# Altium schematic sheet LibreSolar_BMS48V_1.SchDoc: LibreSolar_BMS48V
size 410 x 286 mm; Date: 2018-10-18 5:55:55 PM; SheetNumber: 2; GateName_1: G$1; SymbolName_1: DINA3_L; LibraryName: frames; DeviceSetName: DINA3_L; GateName_2: G$2; SymbolName_2: DOCFIELD
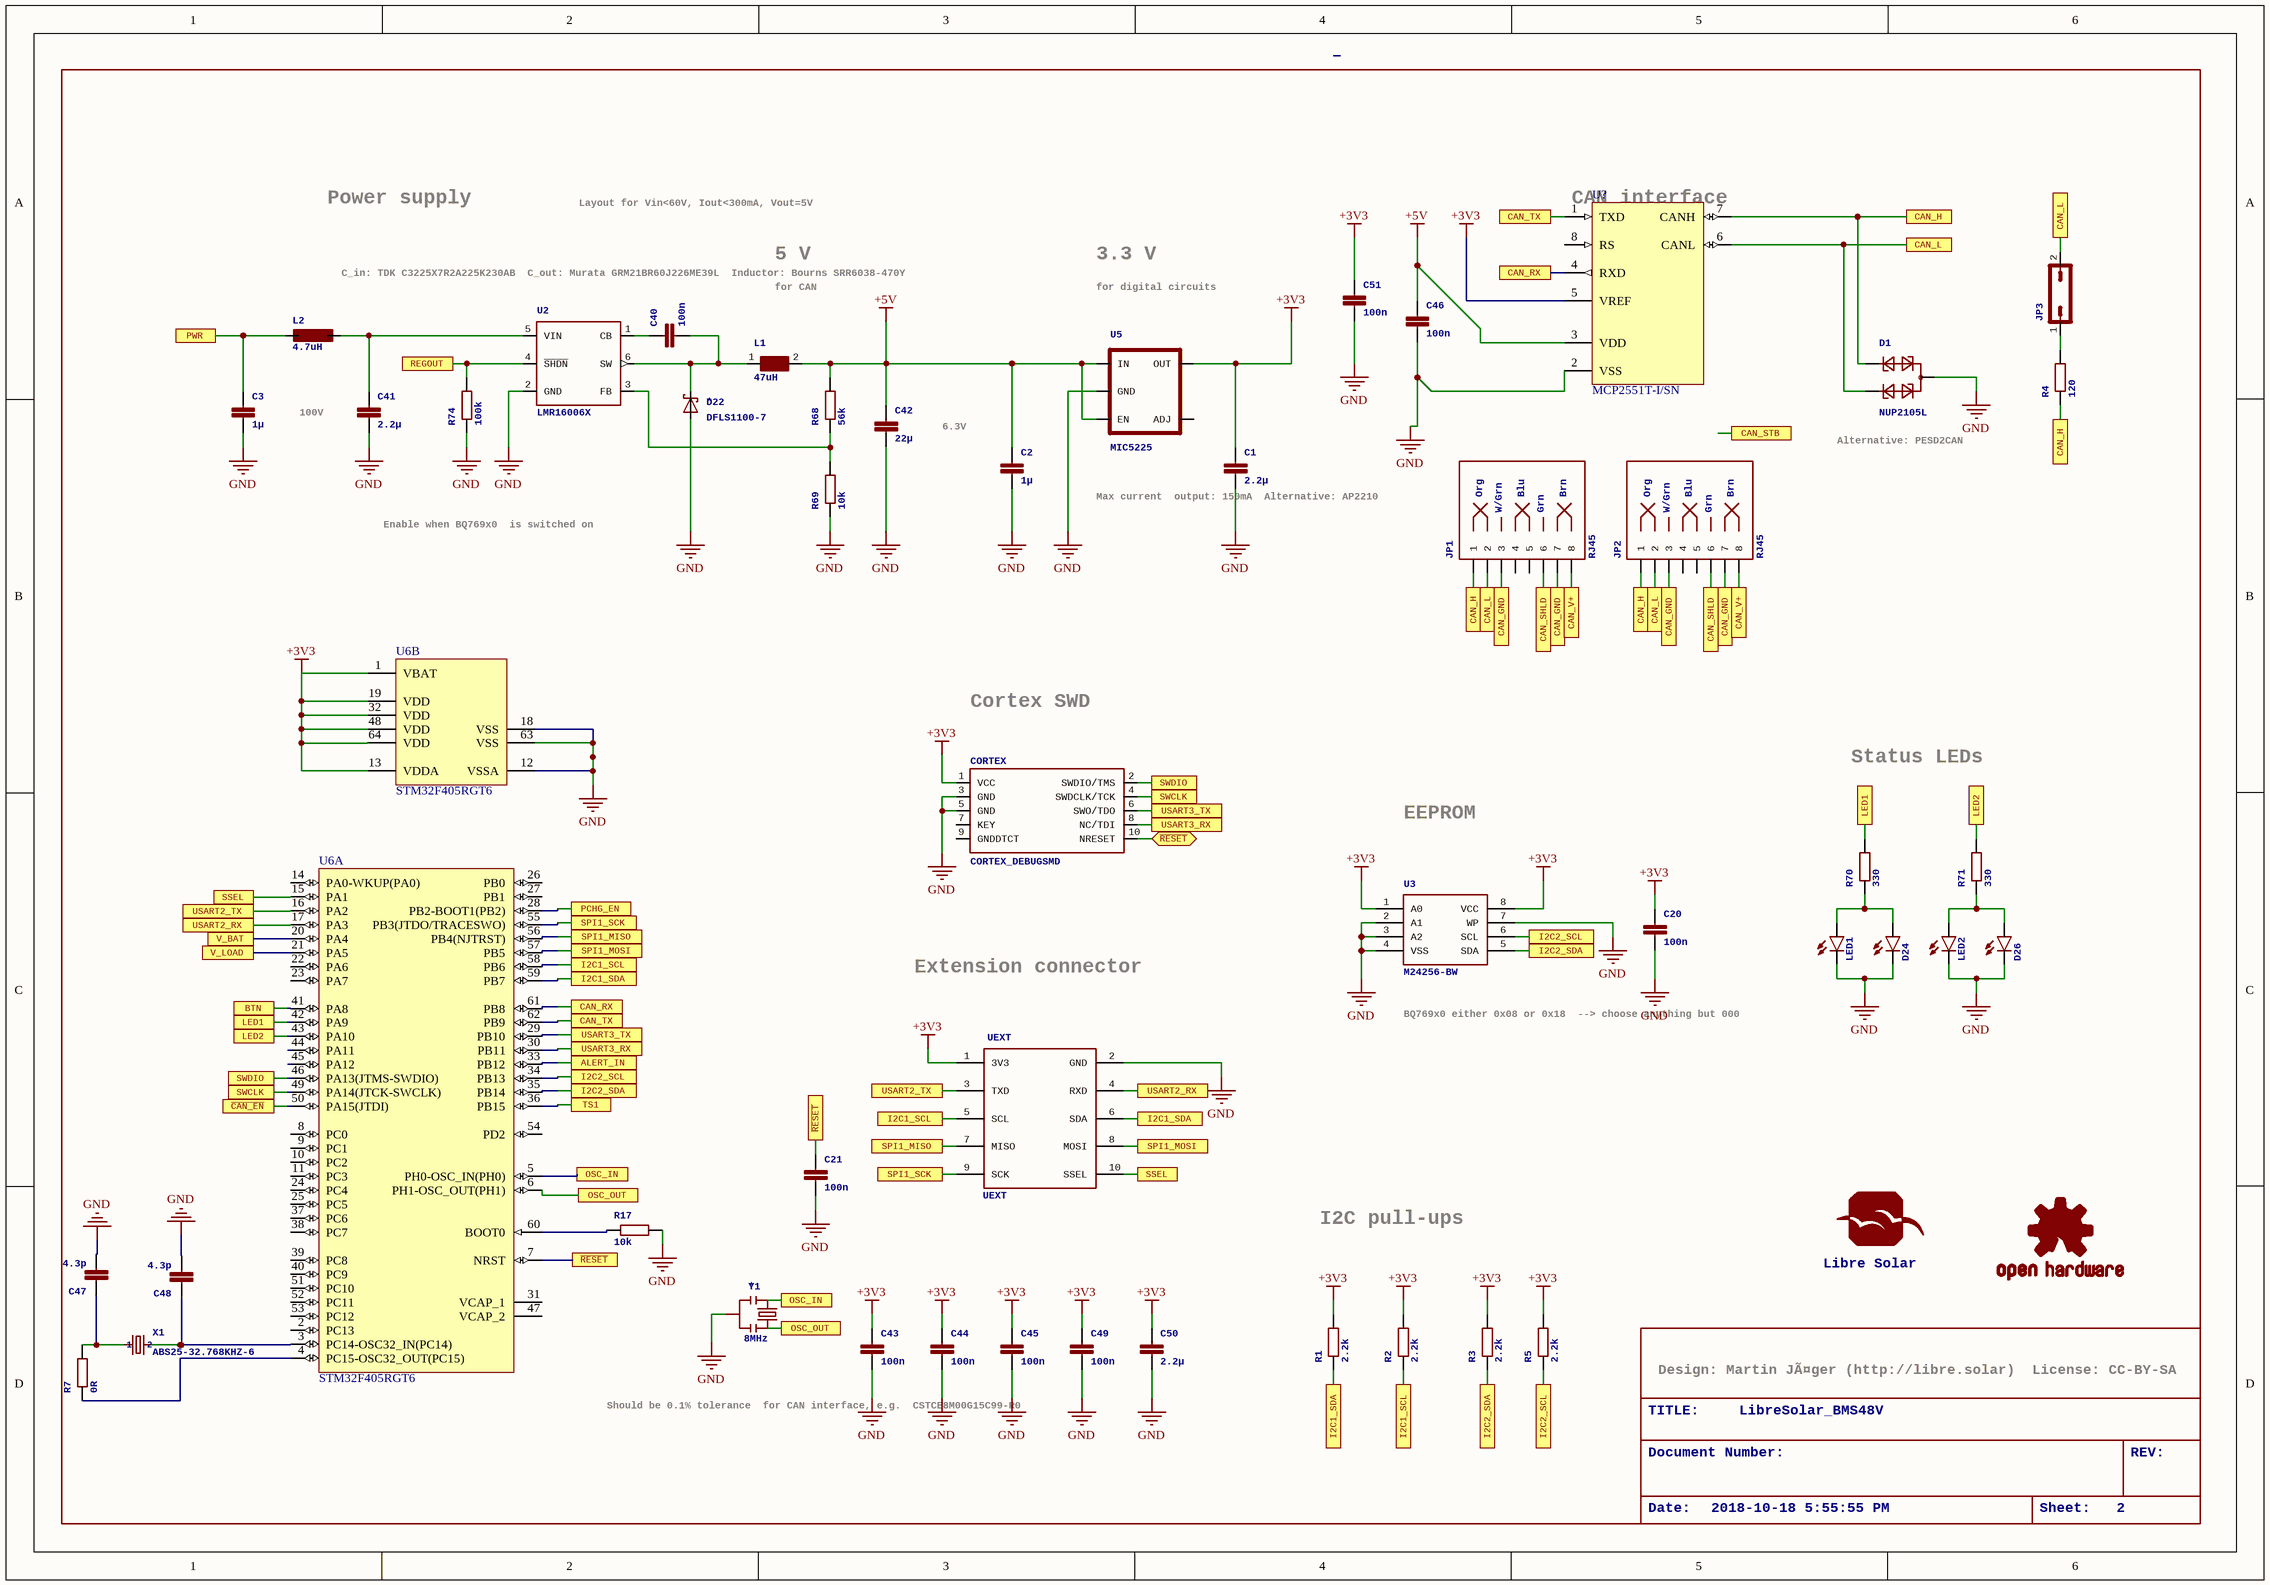
[diagram p0: LibreSolar_BMS48V_1.SchDoc]

## Parts
C1  2.2µ  [C0603]
C2  1µ  [C0603]
C3  1µ  [C0805]
C20  100n  [C0603]
C21  100n  [C0603]
C40  100n  [C0603]
C41  2.2µ  [C1210]
C42  22µ  [C0805]
C43  100n  [C0603]
C44  100n  [C0603]
C45  100n  [C0603]
C46  100n  [C0603]
C47  4.3p  [C0603]
C48  4.3p  [C0603]
C49  100n  [C0603]
C50  2.2µ  [C0603]
C51  100n  [C0603]
CORTEX  CORTEX_DEBUGSMD  [SAMTECH_FTSH-105-01]
D1  NUP2105L  [SOT23]
D22  DFLS1100-7  [POWERDI123]
D24  LED0603  [LED-0603]  (value not drawn)
D26  LED0603  [LED-0603]  (value not drawn)
JP1  RJ45  [RJ45-8]
JP2  RJ45  [RJ45-8]
JP3  JP1Q  [JP1]  (value not drawn)
L1  47uH  [WE-TPC_6823]
L2  4.7uH  [L2012C]
LED1  LED3MM  [LED3MM]  (value not drawn)
LED2  LED3MM  [LED3MM]  (value not drawn)
N1  OSHW-LOGOM  [OSHW-LOGO-M]  (value not drawn)
R1  2.2k  [R0603]
R2  2.2k  [R0603]
R3  2.2k  [R0603]
R4  120  [R1206]
R5  2.2k  [R0603]
R7  0R  [R0603]
R17  10k  [R0603]
R68  56k  [R0603]
R69  10k  [R0603]
R70  330  [R0603]
R71  330  [R0603]
R74  100k  [R0603]
U2  LMR16006X  [SOT23-6]
U3  M24256-BW  [SO08]
U5  MIC5225  [SOT23-5]
U6  STM32F405RGT6  [STM-LQFP64_N]  (parts A,B of 2)
U$1  LibreSolar: Libre Solar  [LIBRESOLAR_LOGO]  (hidden comment: LIBRESOLAR_LOGO)
U?  MCP2551T-I/SN  [SOIC-SN8_N]
UEXT  UEXT  [UEXT]
X1  ABS25-32.768KHZ-6  [MM20SS]
Y1  8MHz  [RESONATOR-SMD-1:1]

## Ports
ALERT_IN, BTN, CAN_GND, CAN_H, CAN_L, CAN_RX, CAN_SHLD, CAN_STB, CAN_TX, CAN_V+, I2C1_SCL, I2C1_SDA, I2C2_SCL, I2C2_SDA, LED1, LED2, OSC_IN, OSC_OUT, PCHG_EN, PWR, REGOUT, SPI1_MISO, SPI1_MOSI, SPI1_SCK, SSEL, SWCLK, SWDIO, TS1, USART2_RX, USART2_TX, USART3_RX, USART3_TX, V_BAT, V_LOAD, ~{CAN_EN}, ~{RESET}, ~{RESET} (bidir)

## Nets
+3V3: C1.1 C20.1 C43.1 C44.1 C45.1 C49.1 C50.1 C51.1 CORTEX.1(VCC) R1.2 R2.2 R3.2 R5.2 U3.1(A0) U3.8(VCC) U5.5(OUT) U6.1(VBAT) U6.13(VDDA) U6.19(VDD) U6.32(VDD) U6.48(VDD) U6.64(VDD) U?.5(VREF) UEXT.1(3V3)
+5V: C2.1 C42.1 C46.1 L1.2 R68.2 U5.1(IN) U5.3(EN) U?.3(VDD)
GND: C1.2 C2.2 C3.2 C20.2 C21.2 C41.2 C42.2 C43.2 C44.2 C45.2 C46.2 C47.2 C48.2 C49.2 C50.2 C51.2 CORTEX.3(GND) CORTEX.5(GND) D1.3 D22.A D24.C D26.C LED1.K(C) LED2.K(C) R17.2 R69.1 R74.1 U2.2(GND) U3.2(A1) U3.3(A2) U3.4(VSS) U3.7(WP) U5.2(GND) U6.12(VSSA) U6.18(VSS) U6.63(VSS) U?.2(VSS) UEXT.2(GND) Y1.2
ALERT_IN: U6.33(PB12) ; port ALERT_IN
BTN: U6.41(PA8) ; port BTN
~{CAN_EN}: U6.50(PA15(JTDI)) ; port ~{CAN_EN}
CAN_GND: JP1.3 JP1.7 JP2.3 JP2.7 ; port CAN_GND
CAN_H: D1.1 JP1.1 JP2.1 R4.1 U?.7(CANH) ; port CAN_H
CAN_L: D1.2 JP1.2 JP2.2 JP3.2 U?.6(CANL) ; port CAN_L
CAN_RX: U6.61(PB8) U?.4(RXD) ; port CAN_RX
CAN_SHLD: JP1.6 JP2.6 ; port CAN_SHLD
CAN_TX: U6.62(PB9) U?.1(TXD) ; port CAN_TX
CAN_V+: JP1.8 JP2.8 ; port CAN_V+
I2C1_SCL: R2.1 U6.58(PB6) UEXT.5(SCL) ; port I2C1_SCL
I2C1_SDA: R1.1 U6.59(PB7) UEXT.6(SDA) ; port I2C1_SDA
I2C2_SCL: R5.1 U3.6(SCL) U6.34(PB13) ; port I2C2_SCL
I2C2_SDA: R3.1 U3.5(SDA) U6.35(PB14) ; port I2C2_SDA
LED1: R70.2 U6.42(PA9) ; port LED1
LED2: R71.2 U6.43(PA10) ; port LED2
OSC_IN: U6.5(PH0-OSC_IN(PH0)) Y1.1 ; port OSC_IN
OSC_OUT: U6.6(PH1-OSC_OUT(PH1)) Y1.3 ; port OSC_OUT
PCHG_EN: U6.28(PB2-BOOT1(PB2)) ; port PCHG_EN
PWR: C3.1 L2.2 ; port PWR
~{RESET}: C21.1 CORTEX.10(NRESET) U6.7(NRST) ; port ~{RESET}
REGOUT: R74.2 U2.4(~{SHDN}) ; port REGOUT
SPI1_MISO: U6.56(PB4(NJTRST)) UEXT.7(MISO) ; port SPI1_MISO
SPI1_MOSI: U6.57(PB5) UEXT.8(MOSI) ; port SPI1_MOSI
SPI1_SCK: U6.55(PB3(JTDO/TRACESWO)) UEXT.9(SCK) ; port SPI1_SCK
SSEL: U6.15(PA1) UEXT.10(SSEL) ; port SSEL
SWCLK: CORTEX.4(SWDCLK/TCK) U6.49(PA14(JTCK-SWCLK)) ; port SWCLK
SWDIO: CORTEX.2(SWDIO/TMS) U6.46(PA13(JTMS-SWDIO)) ; port SWDIO
TS1: U6.36(PB15) ; port TS1
USART2_RX: U6.17(PA3) UEXT.4(RXD) ; port USART2_RX
USART2_TX: U6.16(PA2) UEXT.3(TXD) ; port USART2_TX
USART3_RX: CORTEX.8(NC/TDI) U6.30(PB11) ; port USART3_RX
USART3_TX: CORTEX.6(SWO/TDO) U6.29(PB10) ; port USART3_TX
V_BAT: U6.20(PA4) ; port V_BAT
V_LOAD: U6.21(PA5) ; port V_LOAD
NetC40_1: C40.1 U2.1(CB)
NetC40_2: C40.2 D22.C L1.1 U2.6(SW)
NetC41_1: C41.1 L2.1 U2.5(VIN)
NetC47_1: C47.1 R7.2 X1.1
NetC48_1: C48.1 U6.3(PC14-OSC32_IN(PC14)) X1.4
NetD24_A: D24.A LED1.A R70.1
NetD26_A: D26.A LED2.A R71.1
NetJP3_1: JP3.1 R4.2
NetR7_1: R7.1 U6.4(PC15-OSC32_OUT(PC15))
NetR17_1: R17.1 U6.60(BOOT0)
NetR68_1: R68.1 R69.2 U2.3(FB)

Not connected (* = marked no-connect by the designer): CORTEX 7(KEY) 9(GNDDTCT); JP1 4 5; JP2 4 5; U5 4(ADJ); U6 2(PC13) 8(PC0) 9(PC1) 10(PC2) 11(PC3) 14(PA0-WKUP(PA0)) 22(PA6) 23(PA7) 24(PC4) 25(PC5) 26(PB0) 27(PB1) 31(VCAP_1) 37(PC6) 38(PC7) 39(PC8) 40(PC9) 44(PA11) 45(PA12) 47(VCAP_2) 51(PC10) 52(PC11) 53(PC12) 54(PD2); U? 8(RS)

## Notes on the sheet
- Power supply
- Layout for Vin<60V, Iout<300mA, Vout=5V
- (near U?) CAN interface
- C_in: TDK C3225X7R2A225K230AB
  C_out: Murata GRM21BR60J226ME39L
  Inductor: Bourns SRR6038-470Y
- 5 V
- 3.3 V
- for CAN
- for digital circuits
- 100V
- 6.3V
- (near D1) Alternative: PESD2CAN
- Enable when BQ769x0
  is switched on
- (near C1) Max current
  output: 150mA
  Alternative: AP2210
- Cortex SWD
- Status LEDs
- EEPROM
- Extension connector
- BQ769x0 either 0x08 or 0x18
  --> choose anything but 000
- I2C pull-ups
- Design: Martin JÃ¤ger (http://libre.solar)
  License: CC-BY-SA
- Should be 0.1% tolerance
  for CAN interface, e.g.
  CSTCE8M00G15C99-R0
- TITLE:
- Document Number:
- LibreSolar_BMS48V
- REV:
- Date:
- 2018-10-18 5:55:55 PM
- Sheet:
- 2

## Library data of the parts
C1 C50 = C-EUC0603: CAPACITOR, European symbol; MPN: 0805YC475KAT2A; GateName_1: G$1; SymbolName_1: C-EU; MF: AVX; DeviceName: C0603; LibraryName: rcl; DeviceSetName: C-EU; OC_FARNELL: 1657937
C2 = C-EUC0603: CAPACITOR, European symbol; MPN: 08055C104KAT2A; GateName_1: G$1; SymbolName_1: C-EU; MF: AVX; DeviceName: C0603; LibraryName: rcl; DeviceSetName: C-EU; OC_FARNELL: 499687
C3 = C-EUC0805: CAPACITOR, European symbol; MPN: 08055C104KAT2A; GateName_1: G$1; SymbolName_1: C-EU; MF: AVX; DeviceName: C0805; LibraryName: rcl; DeviceSetName: C-EU; OC_FARNELL: 499687
C20 C21 C43-C45 C47-C49 = C-EUC0603: CAPACITOR, European symbol; MPN: GRM188R71H104KA93D; GateName_1: G$1; SymbolName_1: C-EU; MF: MURATA; DeviceName: C0603; LibraryName: rcl; DeviceSetName: C-EU; OC_FARNELL: 8820023
C40 = C-EUC0603: CAPACITOR, European symbol; MPN: 0603B104K500CT; GateName_1: G$1; SymbolName_1: C-EU; MF: WALSIN; DeviceName: C0603; LibraryName: rcl; DeviceSetName: C-EU; OC_FARNELL: 2496834
C41 = C-EUC1210: CAPACITOR, European symbol; MPN: C3225X7R2A225K230AB; GateName_1: G$1; SymbolName_1: C-EU; MF: TDK; DeviceName: C1210; LibraryName: rcl; DeviceSetName: C-EU; OC_FARNELL: 2112727
C42 = C-EUC0805: CAPACITOR, European symbol; MPN: GRM21BR60J226ME39L; GateName_1: G$1; SymbolName_1: C-EU; MF: MURATA; DeviceName: C0805; LibraryName: rcl; DeviceSetName: C-EU; OC_FARNELL: 1735531
C46 C51 = C-EUC0603: CAPACITOR, European symbol; MPN: 06035C104KAT2A; GateName_1: G$1; SymbolName_1: C-EU; MF: AVX; DeviceName: C0603; LibraryName: rcl; DeviceSetName: C-EU; OC_FARNELL: 1301804
CORTEX = CORTEX_DEBUGSMD: Cortex Debug ConnectorDatasheet; GateName_1: G$1; DeviceName: SMD; SymbolName_1: CORTEX_DEBUG; LibraryName: LibreSolar; DeviceSetName: CORTEX_DEBUG
D1 = PESD2CAN: CAN bus ESD protection diodeSource: http://www.nxp.com/documents/data_sheet/PESD1CAN.pdf; GateName_1: G$1; MF: NXP; SymbolName_1: PESD2CAN; LibraryName: LibreSolar; DeviceSetName: PESD2CAN; MPN: PESD2CAN; OC_FARNELL: 1510712
D22 = SCHOTTKY-DIODEPOWERDI123: Schottky Diode; GateName_1: G$1; MF: DIODES INC.; SymbolName_1: SCHOTTKY; DeviceName: POWERDI123; LibraryName: resolut; DeviceSetName: SCHOTTKY-DIODE; MPN: DFLS1100-7; NAME: *; OC_FARNELL: 1713889
D24 D26 = LED0603: LEDsStandard schematic elements and footprints for 5mm, 3mm, 1206, and 0603 sized LEDs. 5mm - Spark Fun Electronics SKU : COM-00529 (and others); GateName_1: G$1; SymbolName_1: LED; DeviceName: 0603; LibraryName: SparkFun-LED; DeviceSetName: LED; MF: *; MPN: *; OC_FARNELL: unknown
JP1 JP2 = RJ45-8PTH: RJ45 JackSimple RJ45, 8-pin connection - connector for common Cat5, Cat5e, and Cat6 Ethernet cables. Footprint not yet proven in production. Connector sku is PRT-00643; Breakout PCB sku is BOB-00716.; GateName_1: JP1; DeviceName: PTH; MF: AMPHENOL COMMERCIAL PRODUCTS; PROD_ID: CONN-08506; SymbolName_1: RJ45-8; LibraryName: SparkFun-Connectors; DeviceSetName: RJ45-8; MPN: RJHSE-5080; OC_FARNELL: 1860577; Org: Org; Blu: Blu; Brn: Brn; W/Grn: W/Grn; Grn: Grn
JP3 = JP1Q: JUMPER; GateName_1: A; SymbolName_1: J1; LibraryName: jumper; DeviceSetName: JP1Q
L1 = WE-TPC_6823: Shielded Tiny Power Inductor WE-TPC- Extremely flat power inductor- High current capability- High reliability and perfect soldering characteristics  because of integrated soldering pad- magnetically shielded-- Portable power like PDA, digital camera,    PCMICA-cards and displays-- DC/DC-converter-- Recommended for switching regulator IC's from    Linear Technology, National Semiconductor,    Texas Instruments and Fairchild Semiconductor  Details see: http://katalog.we-online.de/en/pbs/WE-TPC?Updated  by  Dan Xu 2014-07-112014 (C) WÃ¼rth Elektronik; GateName_1: G$1; SymbolName_1: -L; DeviceName: _6823; DeviceSetName: WE-TPC; LibraryName: PowerMagnetics
L2 = L-EUL2012C: INDUCTOR, European symbol; GateName_1: G$1; SymbolName_1: L-EU; DeviceName: L2012C; LibraryName: rcl; DeviceSetName: L-EU
LED1 LED2 = LED3MM: LEDsStandard schematic elements and footprints for 5mm, 3mm, 1206, and 0603 sized LEDs. 5mm - Spark Fun Electronics SKU : COM-00529 (and others); GateName_1: G$1; SymbolName_1: LED; DeviceName: 3MM; LibraryName: SparkFun-LED; DeviceSetName: LED; MF: *; MPN: *; OC_FARNELL: unknown
N1 = OSHW-LOGOM: Open Source Hardware Logo This logo indicates the piece of hardware it is found on incorporates a OSHW license and/or adheres to the definition of open source hardware found here: http://freedomdefined.org/OSHW; GateName_1: G$1; DeviceName: M; SymbolName_1: OSHW-LOGO; LibraryName: resolut; DeviceSetName: OSHW-LOGO; MF: *; MPN: *; OC_FARNELL: unknown
R1-R3 R5 = R-EU_R0603: RESISTOR, European symbol; MPN: RC0603FR-072K2L.; GateName_1: G$1; SymbolName_1: R-EU; DeviceSetName: R-EU_; MF: YAGEO (PHYCOMP); DeviceName: R0603; LibraryName: rcl; OC_FARNELL: 9238522
R4 = R-EU_R1206: RESISTOR, European symbol; MPN: WCR0805-120RFI; GateName_1: G$1; SymbolName_1: R-EU; DeviceSetName: R-EU_; MF: WELWYN; DeviceName: R1206; LibraryName: rcl; OC_FARNELL: 1100308
R7 R17 = R-EU_R0603: RESISTOR, European symbol; MPN: RC0603FR-0710KL; GateName_1: G$1; SymbolName_1: R-EU; DeviceSetName: R-EU_; MF: YAGEO (PHYCOMP); DeviceName: R0603; LibraryName: rcl; OC_FARNELL: 9238603
R68 = R-EU_R0603: RESISTOR, European symbol; MPN: CR0805-FX-1001ELF; GateName_1: G$1; SymbolName_1: R-EU; DeviceSetName: R-EU_; MF: BOURNS; DeviceName: R0603; LibraryName: rcl; OC_FARNELL: 2008380
R69 R74 = R-EU_R0603: RESISTOR, European symbol; MPN: ERJ3EKF1002V; GateName_1: G$1; SymbolName_1: R-EU; DeviceSetName: R-EU_; MF: PANASONIC ELECTRONIC COMPONENTS; DeviceName: R0603; LibraryName: rcl; OC_FARNELL: 2303192
R70 R71 = R-EU_R0603: RESISTOR, European symbol; MPN: MCMR06X1001FTL; GateName_1: G$1; SymbolName_1: R-EU; DeviceSetName: R-EU_; MF: MULTICOMP; DeviceName: R0603; LibraryName: rcl; OC_FARNELL: 2073348
U2 = LMR16006SOT-23: LMR16006 SIMPLE SWITCHERÂ® 60 V 0.6 A Buck Regulators With High Efficiency ECO Mode; MPN: LMR16006XDDCT; GateName_1: U1; DeviceName: SOT-23; MF: TEXAS INSTRUMENTS; SymbolName_1: LMR16006; LibraryName: resolut; DeviceSetName: LMR16006; OC_FARNELL: 2455133
U3 = EEPROM-I2CSMD: I2C EEPROM chips, 24LC256 (and others); GateName_1: G$1; DeviceName: SMD; SymbolName_1: EEPROM-I2C; LibraryName: SparkFun-DigitalIC; DeviceSetName: EEPROM-I2C
U5 = V_REG_MIC5235: MPN: MIC5225-3.3YM5-TR; GateName_1: G$1; SymbolName_1: V-REG-LDO-ADJ; MF: MICROCHIP; LibraryName: SparkFun-PowerIC; DeviceSetName: V_REG_MIC5235; OC_FARNELL: 2510262
U6 = STM32F405RGT6: ARM Cortex-M4 32-bit MCU+FPU, 210 DMIPS, 1024 kB Flash, 192 kB Internal RAM, 51 I/Os, 64-pin LQFP, -40 to 85 degC, Tray; Manufacturer: STMicroelectronics; D/A Converter: 2x12-bit; FLASH Size (Prog) (kB): 1024; I/Os (High Current): 51; Internal RAM Size (kB): 192; Operating Frequency(F) (Processor speed) (MHz): 168; Supply Voltage(Vcc) max (V): 3.6; Supply Voltage(Vcc) min (V): 1.8; DatasheetVersion: Rev. 4; PackageVersion: Rev. 4, 06/2013; PackageReference: LQFP64; PackageDescription: 64-Pin Low Profile Quad Flat Package, 10 x 10 mm Body, 0.5 mm Pitch; Supplier 1: Digi-Key; Supplier Part Number 1: 497-11767-ND; Supplier 2: Farnell; Supplier Part Number 2: 2064363; Supplier 3: Newark; Supplier Part Number 3: 73T2329; Supplier 4: Mouser; Supplier Part Number 4: 511-STM32F405RGT6; Core: ARM Cortex-M4; Packing: Tray; Mounting Technology: Surface Mount; PartNumber: STM32F405RGT6; ComponentLink1Description: Manufacturer URL; ComponentLink1URL: http://www.st.com/web/en/home.html; ComponentLink2Description: Datasheet; ComponentLink2URL: http://www.st.com/st-web-ui/static/active/en/resource/technical/document/datasheet/DM00037051.pdf; ComponentLink3Description: Package Specification; ComponentLink3URL: http://www.st.com/st-web-ui/static/active/en/resource/technical/document/datasheet/DM00037051.pdf
U$1 = LIBRESOLAR_LOGO: GateName_1: G$1; SymbolName_1: LIBRESOLAR_LOGO; LibraryName: LibreSolar; DeviceSetName: LIBRESOLAR_LOGO
U? = MCP2551T-I/SN: High-Speed CAN Transceiver, 8-Pin SOIC, Industrial Temperature, Tape and Reel; Manufacturer: Microchip; DatasheetVersion: revF, Jul-2010; PackageVersion: revBB, Aug-2009; PackageReference: SOIC-SN8; PackageDescription: 8-Lead Plastic Small Outline (SN) - Narrow, 3.90mm Body [SOIC]; Supplier 1: Digi-Key; Supplier Part Number 1: MCP2551T-I/SNTR-ND; Supplier 2: Newark; Supplier Part Number 2: 92C4188; Supplier 3: Mouser; Supplier Part Number 3: 579-MCP2551T-I/SN; Mounting Technology: Surface Mount; Code_JEDEC: MS-012; Code_IPC: SOIC127P600-8; PartNumber: MCP2551T-I/SN; ComponentLink1Description: Manufacturer URL; ComponentLink1URL: http://www.microchip.com/; ComponentLink2Description: Datasheet; ComponentLink2URL: http://ww1.microchip.com/downloads/en/DeviceDoc/21667F.pdf; ComponentLink3Description: Package Specification; ComponentLink3URL: http://www.microchip.com/stellent/groups/techpub_sg/documents/packagingspec/en012702.pdf
UEXT = UEXT: WR-BHD 2.54mm Male Box Header, 10 Pins=>Code : Con_WTB_BHD_2.54_Male_THT_WS_61201021621  Details see: http://katalog.we-online.de/en/em/612_0xx_216_21Created 2014-06-04, Karrer Zheng2014 (C) WÃ¼rth Elektronik; GateName_1: G$1; SymbolName_1: UEXT; LibraryName: LibreSolar; DeviceSetName: UEXT
X1 = CRYSTALMM20SS: CRYSTAL; GateName_1: G$1; SymbolName_1: Q; DeviceName: MM20SS; LibraryName: crystal; DeviceSetName: CRYSTAL; MF: *; MPN: *; OC_FARNELL: unknown; OC_NEWARK: unknown; 1: 1; 2: 2
Y1 = RESONATOR1:1: ResonatorSmall SMD resonator. This is the itty bitty 10/20MHz resonators with built in caps. CSTCE10M0G55 and CSTCE20M0V53. Footprint for SMD has been used in SFE production for years, and does work okay. 1:1 is an attempt to get larger fillets on the sides so it will be easier to inspect these solders in our AOI machine. The pads have been minimized to match the actual metal under the resonator. To see this relation, it includes an image import of the bottom side of the component. Imported to scale on layer 200.; MPN: CSTCE8M00G15C99-R0; GateName_1: G$1; MF: MURATA; SymbolName_1: RESONATOR; DeviceName: 1:1; LibraryName: Testing; DeviceSetName: RESONATOR; NAME: *